# Altium project Hydrophones_FrontEnd_Module_1.PrjPcb
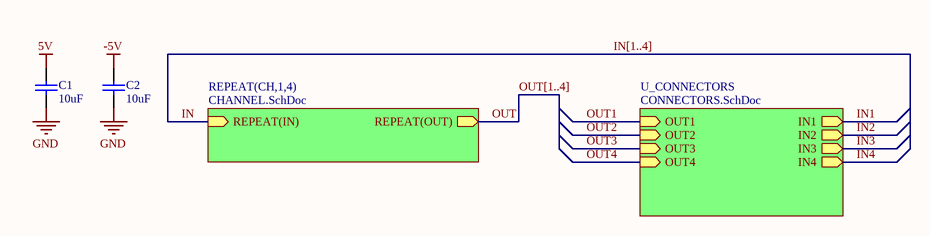
[diagram p0: BOARD.SchDoc]
3 sheets, 56 parts. Net scope: hierarchical (ports join the sheet entries above them; power ports are global).
Board file: BOARD.PcbDoc
Sheets:
  BOARD.SchDoc
    CH1 = CHANNEL.SchDoc
    CH2 = CHANNEL.SchDoc
    CH3 = CHANNEL.SchDoc
    CH4 = CHANNEL.SchDoc
    U_CONNECTORS = CONNECTORS.SchDoc

## Sheet BOARD.SchDoc
size A

### Parts
C1  value 10uF  [1608[0603]]  (hidden comment: Cap Semi)
C2  value 10uF  [1608[0603]]  (hidden comment: Cap Semi)

### Sub-sheets
REPEAT(CH,1,4) = CHANNEL.SchDoc: REPEAT(IN) (in), REPEAT(OUT) (out)
U_CONNECTORS = CONNECTORS.SchDoc: IN1 (out), IN2 (out), IN3 (out), IN4 (out), OUT1 (in), OUT2 (in), OUT3 (in), OUT4 (in)

### Nets
5V: C1.2
-5V: C2.2
GND: C1.1 C2.1
IN: sheet REPEAT(CH,1,4)/REPEAT(IN)
OUT: sheet REPEAT(CH,1,4)/REPEAT(OUT)

### Buses and harness runs
bus IN[1..4]
bus OUT[1..4]

### Library data of the parts
C1 C2 = Cap Semi: Capacitor (Semiconductor SIM Model); Published: 8-Jun-2000; LatestRevisionDate: 29-May-2009; LatestRevisionNote: IPC-7351 Footprint Added.; PackageReference: C1206; Publisher: Altium Limited; PackageDescription: Chip Capacitor

## Sheet CHANNEL.SchDoc
size A
Used 4 times, as channels CH1, CH2, CH3, CH4. Parts and nets are listed once, with the designators drawn on the sheet.
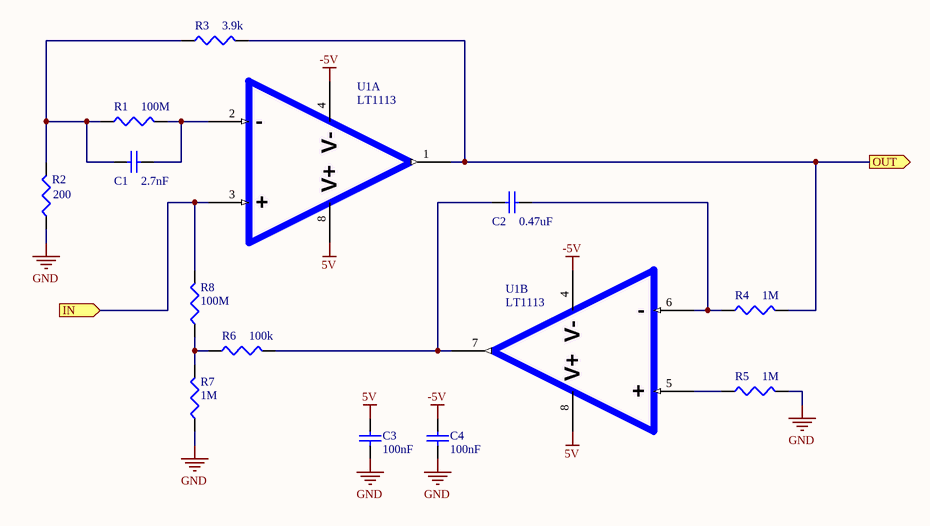
[diagram p1: CHANNEL.SchDoc]

### Parts
C1  value 2.7nF  [1608[0603]]  (hidden comment: Cap Semi)
C2  value 0.47uF  [1608[0603]]  (hidden comment: Cap Semi)
C3  value 100nF  [1608[0603]]  (hidden comment: Cap Semi)
C4  value 100nF  [1608[0603]]  (hidden comment: Cap Semi)
R1  value 100M  [J1-0603]  (hidden comment: Res3)
R2  value 200  [J1-0603]  (hidden comment: Res3)
R3  value 3.9k  [J1-0603]  (hidden comment: Res3)
R4  value 1M  [J1-0603]  (hidden comment: Res3)
R5  value 1M  [J1-0603]  (hidden comment: Res3)
R6  value 100k  [J1-0603]  (hidden comment: Res3)
R7  value 1M  [J1-0603]  (hidden comment: Res3)
R8  value 100M  [J1-0603]  (hidden comment: Res3)
U1  LT1113  [SO8_L]  (parts A,B of 2)

### Ports
IN (in), OUT (out)

### Nets
5V: C3.2 U1.8(V+)
-5V: C4.2 U1.4(V-)
GND: C3.1 C4.1 R2.1 R5.2 R7.1
IN: R8.2 U1.3(+) ; port IN
OUT: R3.2 R4.2 U1.1(OUTA) ; port OUT
NetC1_1: C1.1 R1.1 R2.2 R3.1
NetC1_2: C1.2 R1.2 U1.2(-)
NetC2_1: C2.1 R6.2 U1.7(OUTA)
NetC2_2: C2.2 R4.1 U1.6(-)
NetR5_1: R5.1 U1.5(+)
NetR6_1: R6.1 R7.2 R8.1

### Channels
CH1: designators end in _CH1; ports IN=IN1 OUT=OUT1
CH2: designators end in _CH2; ports IN=IN2 OUT=OUT2
CH3: designators end in _CH3; ports IN=IN3 OUT=OUT3
CH4: designators end in _CH4; ports IN=IN4 OUT=OUT4

### Library data of the parts
C1-C4 = Cap Semi: Capacitor (Semiconductor SIM Model); Published: 8-Jun-2000; LatestRevisionDate: 29-May-2009; LatestRevisionNote: IPC-7351 Footprint Added.; PackageReference: C1206; Publisher: Altium Limited; PackageDescription: Chip Capacitor
R1-R8 = Res3: Resistor; Published: 8-Jun-2000; LatestRevisionDate: 29-May-2009; LatestRevisionNote: IPC-7351 Footprint Added.; PackageReference: J1-0603; Publisher: Altium Limited; PackageDescription: Chip Resistor
U1 = LT1113: LT1113 Opamp

## Sheet CONNECTORS.SchDoc
size A
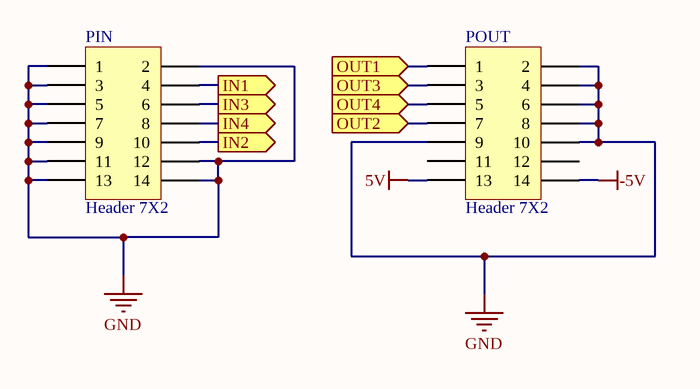
[diagram p2: CONNECTORS.SchDoc]

### Parts
PIN  Header 7X2  [CONN_14x2_0.5IN]
POUT  Header 7X2  [CONN_14x2_0.5IN]

### Ports
IN1 (out), IN2 (out), IN3 (out), IN4 (out), OUT1 (in), OUT2 (in), OUT3 (in), OUT4 (in)

### Nets
5V: POUT.13
-5V: POUT.14
GND: PIN.1 PIN.2 PIN.3 PIN.5 PIN.7 PIN.9 PIN.11 PIN.12 PIN.13 PIN.14 POUT.2 POUT.4 POUT.6 POUT.8 POUT.9 POUT.10
IN1: PIN.4 ; port IN1
IN2: PIN.10 ; port IN2
IN3: PIN.6 ; port IN3
IN4: PIN.8 ; port IN4
OUT1: POUT.1 ; port OUT1
OUT2: POUT.7 ; port OUT2
OUT3: POUT.3 ; port OUT3
OUT4: POUT.5 ; port OUT4

Not connected (* = marked no-connect by the designer): POUT 11 12

### Library data of the parts
PIN POUT = Header 7X2: Header, 7-Pin, Dual row; LatestRevisionDate: 17-Jul-2002; LatestRevisionNote: Re-released for DXP Platform.; Publisher: Altium Limited

## Nets that join several sheets
5V: BOARD (C1.2), CH1 (C3_CH1.2 U1_CH1.8), CH2 (C3_CH2.2 U1_CH2.8), CH3 (C3_CH3.2 U1_CH3.8), CH4 (C3_CH4.2 U1_CH4.8), CONNECTORS (POUT.13)
-5V: BOARD (C2.2), CH1 (C4_CH1.2 U1_CH1.4), CH2 (C4_CH2.2 U1_CH2.4), CH3 (C4_CH3.2 U1_CH3.4), CH4 (C4_CH4.2 U1_CH4.4), CONNECTORS (POUT.14)
GND: BOARD (C1.1 C2.1), CH1 (5 pins), CH2 (5 pins), CH3 (5 pins), CH4 (5 pins), CONNECTORS (16 pins)
IN1: CH1 (R8_CH1.2 U1_CH1.3), CONNECTORS (PIN.4)
IN2: CH2 (R8_CH2.2 U1_CH2.3), CONNECTORS (PIN.10)
IN3: CH3 (R8_CH3.2 U1_CH3.3), CONNECTORS (PIN.6)
IN4: CH4 (R8_CH4.2 U1_CH4.3), CONNECTORS (PIN.8)
OUT1: CH1 (R3_CH1.2 R4_CH1.2 U1_CH1.1), CONNECTORS (POUT.1)
OUT2: CH2 (R3_CH2.2 R4_CH2.2 U1_CH2.1), CONNECTORS (POUT.7)
OUT3: CH3 (R3_CH3.2 R4_CH3.2 U1_CH3.1), CONNECTORS (POUT.3)
OUT4: CH4 (R3_CH4.2 R4_CH4.2 U1_CH4.1), CONNECTORS (POUT.5)